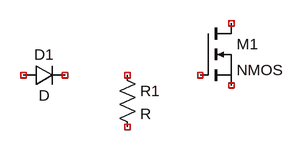
[diagram p0: schematic Draft1.asc]
Draft1.asc, the LTspice schematic file:
Version 4.1
SHEET 1 880 680
SYMBOL nmos 224 128 R0
SYMATTR InstName M1
SYMBOL res 96 192 R0
SYMATTR InstName R1
SYMBOL diode -48 224 R270
WINDOW 0 32 32 VTop 2
WINDOW 3 0 32 VBottom 2
SYMATTR InstName D1

The netlist it stands for:
* Draft1.asc
M1 NC_01 NC_02 NC_03 NC_03 NMOS
R1 NC_04 NC_05 R
D1 NC_06 NC_07 D
.model D D
.lib standard.dio
.model NMOS NMOS
.model PMOS PMOS
.lib standard.mos
.backanno
.end